# Altium schematic sheet OLED.SchDoc
size 209 x 148 mm
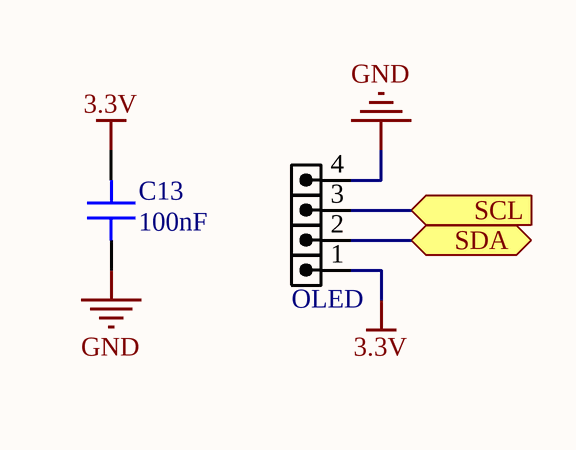
[diagram p0: OLED.SchDoc]

## Parts
C13  100nF  [CAP 0603_1608]
OLED  HDR4  [HDR1SE_M_1X4]  (value not drawn)

## Ports
SCL (in), SDA (bidir)

## Nets
3.3V: C13.2 OLED.1
GND: C13.1 OLED.4
SCL: OLED.3 ; port SCL
SDA: OLED.2 ; port SDA

## Library data of the parts
C13 = Cap 0603: SMT Capacitor; VALUE: 100nF
OLED = HDRTST_1X4: HEADER, 1mm pitch, test, SMD; VALUE: HDR4